# Altium schematic sheet sht_rs485.SchDoc
size A
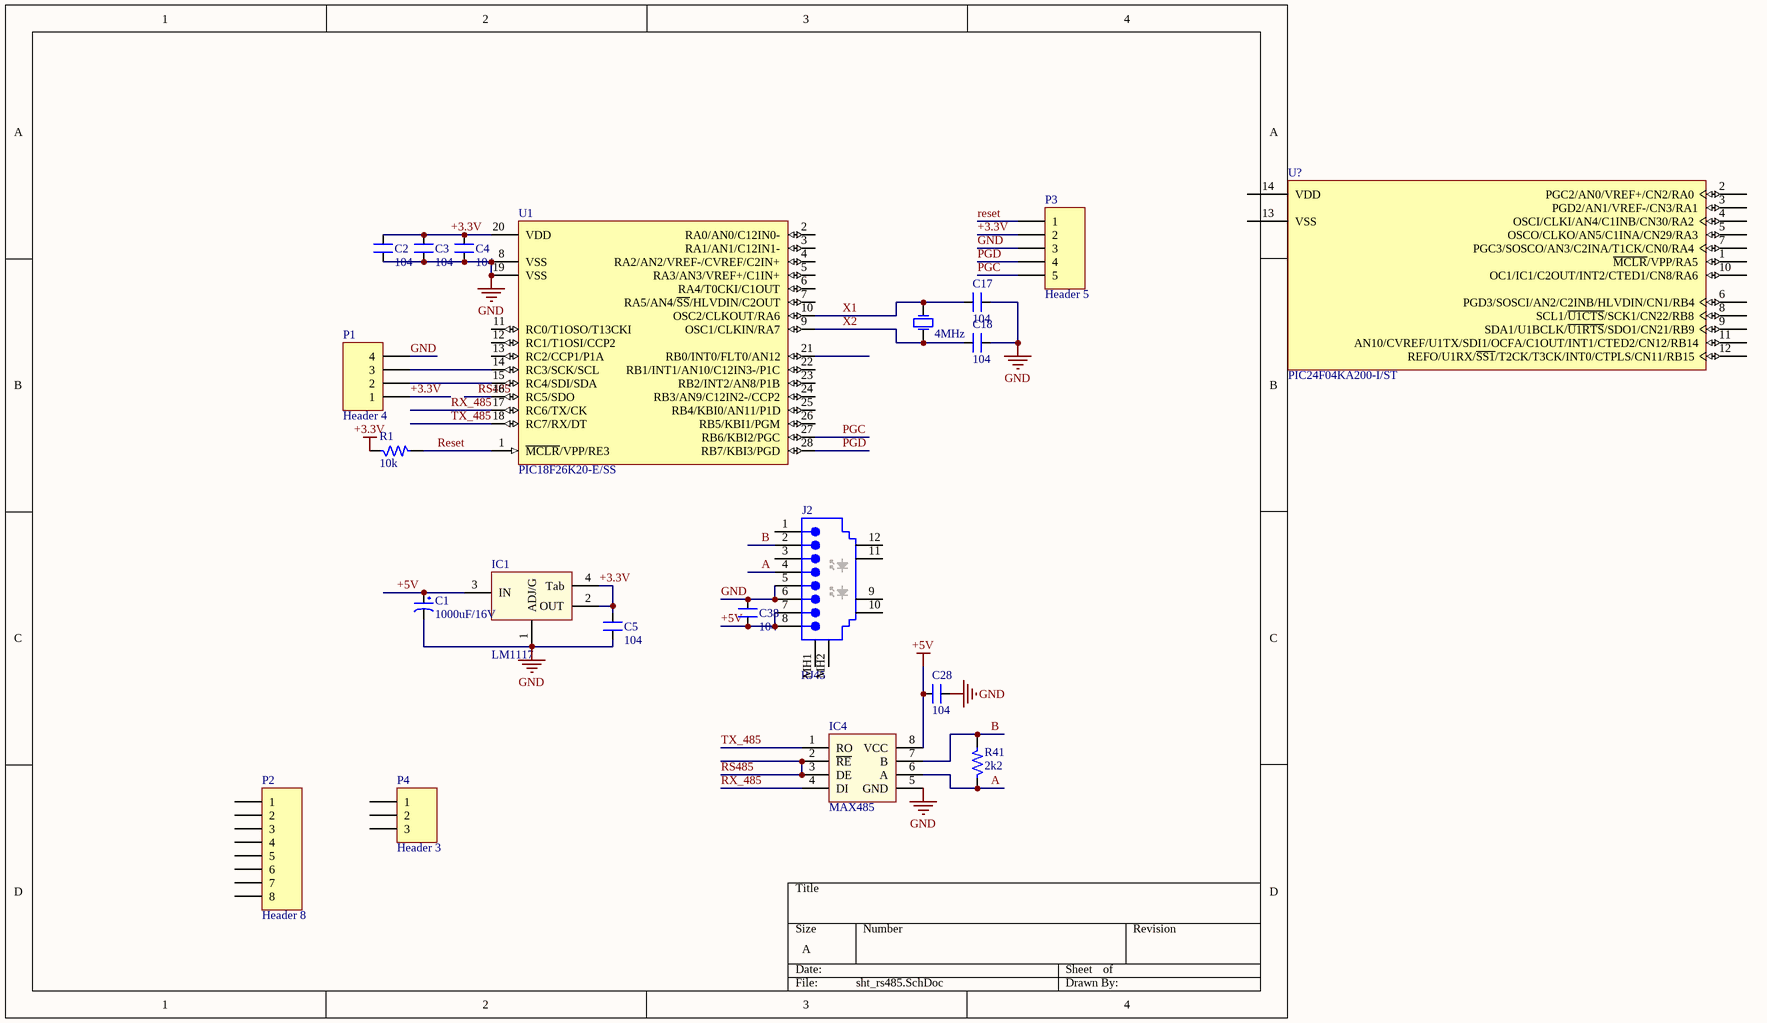
[diagram p0: sht_rs485.SchDoc]

## Parts
C1  1000uF/16V  [CP2/4]
C2  104  [SM-0805]
C3  104  [SM-0805]
C4  104  [SM-0805]
C5  104  [SM-0805]
C17  104  [SM-0805]
C18  104  [SM-0805]
C28  104  [SM-0805]
C38  104  [SM-0805]
IC1  LM1117  [SOT223-4N]
IC4  MAX485  [DIP8/W0.3]
J2  RJ45  [RJ45]
P1  Header 4  [HDR1X4]
P2  Header 8  [HDR1X8]
P3  Header 5  [CON5]
P4  Header 3  [HDR1X3]
R1  10k  [SM-0805]
R41  2k2  [SM-0805]
U1  PIC18F26K20-E/SS  [SOIC-SO28_N]
U?  PIC24F04KA200-I/ST  [TSSOP-ST14_N]
Y2  4MHz  [XTAL]

## Nets
+3.3V: C2.1 C3.1 C4.1 C5.1 IC1.2(OUT) IC1.4(Tab) P1.1 P3.2 R1.1 U1.20(VDD)
+5V: C1.1 C28.2 C38.2 IC1.3(IN) IC4.8(VCC) J2.7 J2.8
GND: C1.2 C2.2 C3.2 C4.2 C5.2 C17.1 C18.1 C28.1 C38.1 IC1.1(ADJ/G) IC4.5(GND) J2.5 J2.6 P1.4 P3.3 U1.8(VSS) U1.19(VSS)
A: IC4.6(A) J2.4 R41.1
B: IC4.7(B) J2.2 R41.2
PGC: P3.5 U1.27(RB6/KBI2/PGC)
PGD: P3.4 U1.28(RB7/KBI3/PGD)
reset: P3.1 R1.2 U1.1(~{MCLR}/VPP/RE3)
RS485: IC4.2(~{RE}) IC4.3(DE) U1.16(RC5/SDO)
RX_485: IC4.4(DI) U1.17(RC6/TX/CK)
TX_485: IC4.1(RO) U1.18(RC7/RX/DT)
X1: C17.2 U1.10(OSC2/CLKOUT/RA6) Y2.2(OSC2)
X2: C18.2 U1.9(OSC1/CLKIN/RA7) Y2.1(OSC1)
NetP1_2: P1.2 U1.15(RC4/SDI/SDA)
NetP1_3: P1.3 U1.14(RC3/SCK/SCL)

Not connected (* = marked no-connect by the designer): J2 1 3 9 10 11 12 MH1(Shield) MH2(Shield); P2 1 2 3 4 5 6 7 8; P4 1 2 3; U1 2(RA0/AN0/C12IN0-) 3(RA1/AN1/C12IN1-) 4(RA2/AN2/VREF-/CVREF/C2IN+) 5(RA3/AN3/VREF+/C1IN+) 6(RA4/T0CKI/C1OUT) 7(RA5/AN4/~{SS}/HLVDIN/C2OUT) 11(RC0/T1OSO/T13CKI) 12(RC1/T1OSI/CCP2) 13(RC2/CCP1/P1A) 21(RB0/INT0/FLT0/AN12) 22(RB1/INT1/AN10/C12IN3-/P1C) 23(RB2/INT2/AN8/P1B) 24(RB3/AN9/C12IN2-/CCP2) 25(RB4/KBI0/AN11/P1D) 26(RB5/KBI1/PGM); U? 1(~{MCLR}/VPP/RA5) 2(PGC2/AN0/VREF+/CN2/RA0) 3(PGD2/AN1/VREF-/CN3/RA1) 4(OSCI/CLKI/AN4/C1INB/CN30/RA2) 5(OSCO/CLKO/AN5/C1INA/CN29/RA3) 6(PGD3/SOSCI/AN2/C2INB/HLVDIN/CN1/RB4) 7(PGC3/SOSCO/AN3/C2INA/T1CK/CN0/RA4) 8(SCL1/~{U1CTS}/SCK1/CN22/RB8) 9(SDA1/U1BCLK/~{U1RTS}/SDO1/CN21/RB9) 10(OC1/IC1/C2OUT/INT2/CTED1/CN8/RA6) 11(AN10/CVREF/U1TX/SDI1/OCFA/C1OUT/INT1/CTED2/CN12/RB14) 12(REFO/U1RX/~{SS1}/T2CK/T3CK/INT0/CTPLS/CN11/RB15) 13(VSS) 14(VDD)

## Library data of the parts
C1 = CP4: Cap 1000uF/16V - 220uF/50V; Description 5: 4,7uF>10uF/250V_3,3uF>10uF/400V - 2,2uF>4,7uF/450V; Description 1: 2200uF-3300uF/6,3V - 1000uF-2200uF/10V; Description 2: 1000uF/16V - 470uF => 1000uF/25V - 100uF/100V; Description 3: 330uF>470uF/35V_220uF>470uF/50V_10uF>22uF/250V; Description 4: 220uF => 330uF/63V - 10uF =>33uF/160 - 200V; Value: 1000uF/16V
C2-C5 C17 C18 C28 C38 = CM: Cap SMD; Value: 103
IC1 = LM1117: 3v3; Value: LM317
IC4 = MAX485: RS232 - RS485 (Same sn75176)
J2 = RJ45: RJ45 Connector, with Leds
P1 = Header 4: Header, 4-Pin; LatestRevisionDate: 17-Jul-2002; LatestRevisionNote: Re-released for DXP Platform.; Publisher: Altium Limited
P2 = Header 8: Header, 8-Pin; LatestRevisionDate: 17-Jul-2002; LatestRevisionNote: Re-released for DXP Platform.; Publisher: Altium Limited
P3 = Header 5: Header, 5-Pin; LatestRevisionDate: 17-Jul-2002; LatestRevisionNote: Re-released for DXP Platform.; Publisher: Altium Limited
P4 = Header 3: Header, 3-Pin; LatestRevisionDate: 17-Jul-2002; LatestRevisionNote: Re-released for DXP Platform.; Publisher: Altium Limited
R1 R41 = R: Resistor 1/4W; Value: R1/4W - 1K
U1 = PIC18F26K20-E/SS: Flash Microcontroller with 10-Bit A/D and nanoWatt Technology, 64K Flash, 28-Pin SSOP, Extended Temperature Range; Published: 29-Jan-2009; DatasheetVersion: revD, Sep-2008; PackageVersion: revAW, Oct-2008; PackageReference: SSOP-SS28; Publisher: Altium Limited; PackageDescription: 28-Lead Plastic Shrink Small Outline (SS) - 5.3mm Body [SSOP]; Code_JEDEC: MS-150; Code_IPC: SOP65P780-28; ComponentLink1Description: Manufacturer Link; ComponentLink1URL: http://www.microchip.com; ComponentLink2Description: Datasheet; ComponentLink2URL: http://ww1.microchip.com/downloads/en/DeviceDoc/41303D.pdf; ComponentLink3Description: Packaging Specification; ComponentLink3URL: http://ww1.microchip.com/downloads/en/PackagingSpec/00049AW.pdf
U? = PIC24F04KA200-I/ST: General Purpose 16-Bit Flash Microcontroller with nanoWatt XLP Technology, 4KB Flash, 512 bytes SRAM, 14-Pin TSSOP, Industrial Temperature; Published: 2-Dec-2009; LatestRevisionDate: 07-Oct-2010; LatestRevisionNote: Supplier links updated.; DatasheetVersion: revB, May-2009; PackageVersion: revBB, Aug-2009; PackageReference: TSSOP-ST14; Publisher: Altium Limited; PackageDescription: 14-Lead Plastic Thin Shrink Small Outline (ST) - 4.4mm Body [TSSOP]; Supplier 1: Digi-Key; Supplier Part Number 1: PIC24F04KA200-I/ST-ND; Supplier 2: Farnell; Supplier Part Number 2: 1740232; ComponentLink1Description: Datasheet; ComponentLink1URL: http://ww1.microchip.com/downloads/en/DeviceDoc/39937b.pdf; ComponentLink2Description: Packaging Specification; ComponentLink2URL: http://www.microchip.com/stellent/groups/techpub_sg/documents/packagingspec/en012702.pdf; ComponentLink3Description: Microchip.com Home; ComponentLink3URL: http://www.microchip.com/
Y2 = XTAL: Crystal Oscillator; Published: 8-Jun-2000; LatestRevisionDate: 17-Jul-2002; LatestRevisionNote: Re-released for DXP Platform.; PackageReference: R38; Publisher: Altium Limited